# Altium schematic sheet Connectors.SchDoc: Panel
size 420 x 297 mm; Author: G.Kasprowicz; CompanyName: WUT ISE; DrawnBy: G.Kasprowicz; Organization: WUT ISE; Address1: PW ISE; Address2: Nowowiejska 15/19 00-665 Warsaw; Address3: gkasprow@gmail.com; DocumentNumber: 1; Revision: 2; SheetNumber: 1; SheetTotal: 3; ModifiedBy: -; CheckedDate: -; Title2: Connectors; DivGrp: WUT ISE; Designer: G.Kasprowicz; ModifiedDate: -; ProjectName: Sensor Box
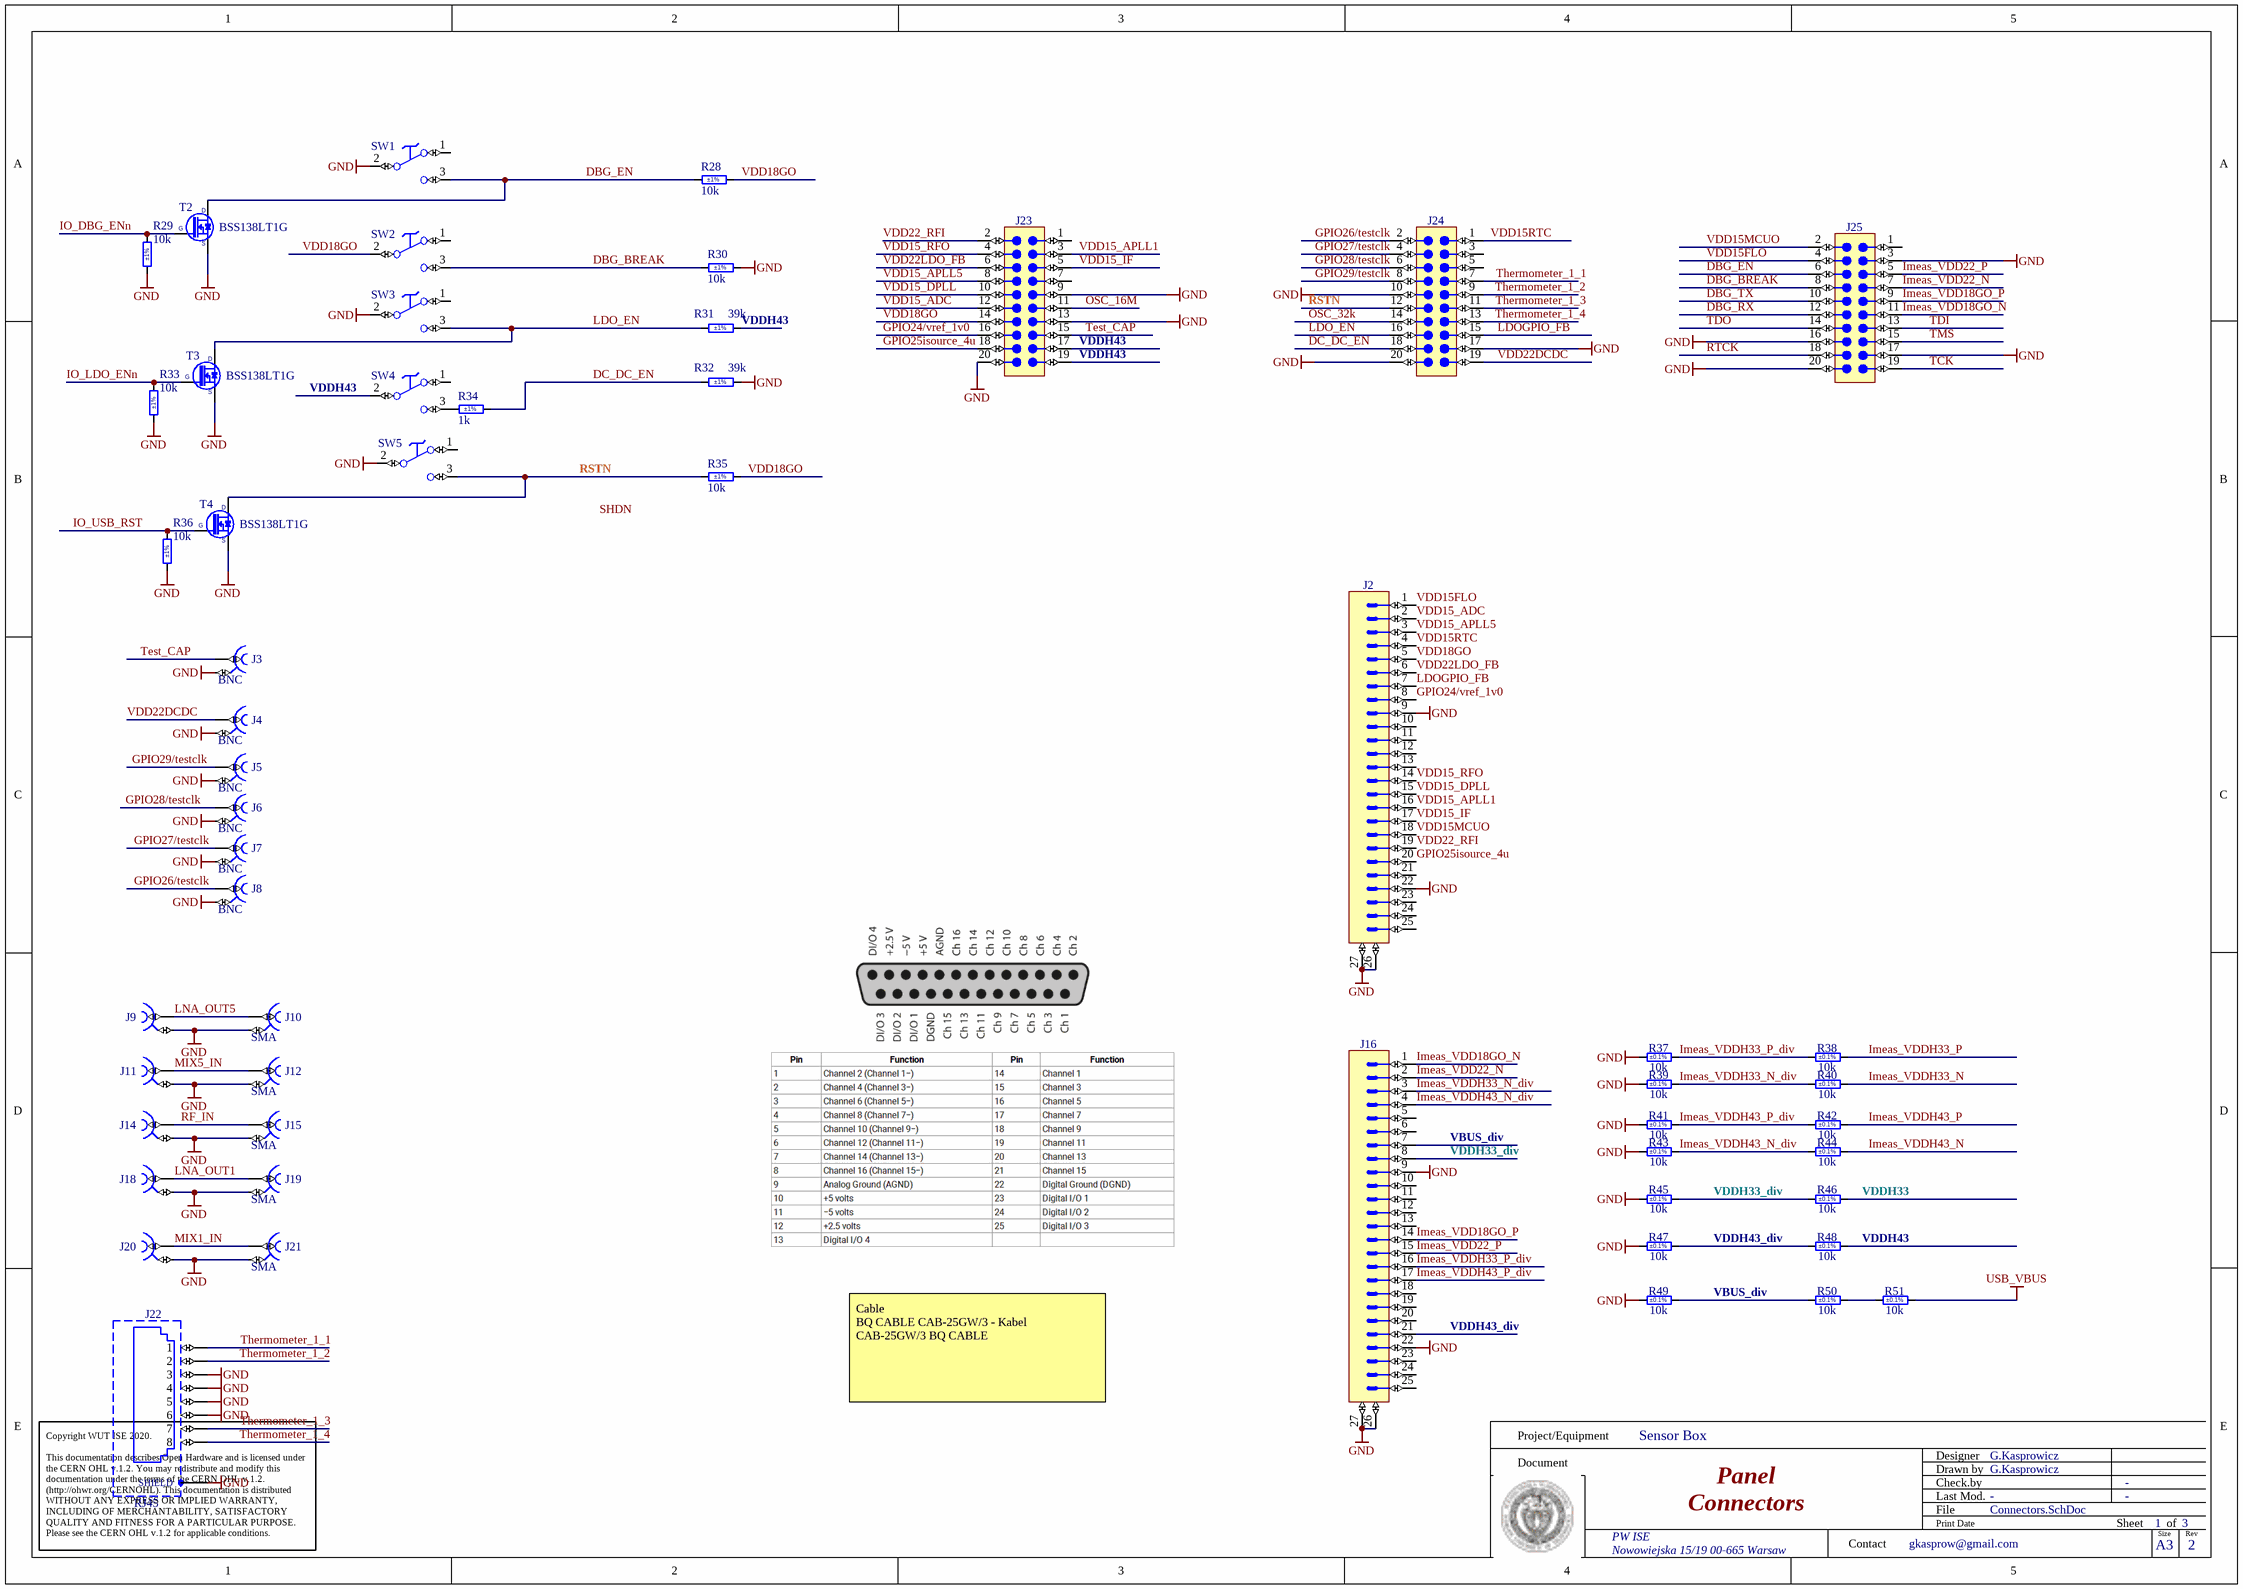
[diagram p0: Connectors.SchDoc]

## Parts
J2  D-Sub  [AMPHENOL_L717SDBH25POL2RM8C309]  (value not drawn)
J3  BNC  [TYCO_5-1634506-1]
J4  BNC  [TYCO_5-1634506-1]
J5  BNC  [TYCO_5-1634506-1]
J6  BNC  [TYCO_5-1634506-1]
J7  BNC  [TYCO_5-1634506-1]
J8  BNC  [TYCO_5-1634506-1]
J9  Coax_1Female_1Shield  [SAMTEC_MMCX-J-P-H-ST-TH1]  (value not drawn)
J10  SMA  [SAMTEC_SMA-J-P-H-ST-TH1]
J11  Coax_1Female_1Shield  [SAMTEC_MMCX-J-P-H-ST-TH1]  (value not drawn)
J12  SMA  [SAMTEC_SMA-J-P-H-ST-TH1]
J14  Coax_1Female_1Shield  [SAMTEC_MMCX-J-P-H-ST-TH1]  (value not drawn)
J15  SMA  [SAMTEC_SMA-J-P-H-ST-TH1]
J16  D-Sub  [AMPHENOL_L717SDBH25POL2RM8C309]  (value not drawn)
J18  Coax_1Female_1Shield  [SAMTEC_MMCX-J-P-H-ST-TH1]  (value not drawn)
J19  SMA  [SAMTEC_SMA-J-P-H-ST-TH1]
J20  Coax_1Female_1Shield  [SAMTEC_MMCX-J-P-H-ST-TH1]  (value not drawn)
J21  SMA  [SAMTEC_SMA-J-P-H-ST-TH1]
J22  RJ45  [TYCO_6368150-1]
J23  Header 20  [3M_45220-600230]  (value not drawn)
J24  Header 20  [3M_45220-600230]  (value not drawn)
J25  Header 20  [3M_45220-600230]  (value not drawn)
R28  10k  Tolerance: ±1%  [RESC1005X40N]
R29  10k  Tolerance: ±1%  [RESC1005X40N]
R30  10k  Tolerance: ±1%  [RESC1005X40N]
R31  39k  Tolerance: ±1%  [RESC1005X40N]
R32  39k  Tolerance: ±1%  [RESC1005X40N]
R33  10k  Tolerance: ±1%  [RESC1005X40N]
R34  1k  Tolerance: ±1%  [RESC1005X40N]
R35  10k  Tolerance: ±1%  [RESC1005X40N]
R36  10k  Tolerance: ±1%  [RESC1005X40N]
R37  10k  Tolerance: ±0.1%  [RESC1608X55N]
R38  10k  Tolerance: ±0.1%  [RESC1608X55N]
R39  10k  Tolerance: ±0.1%  [RESC1608X55N]
R40  10k  Tolerance: ±0.1%  [RESC1608X55N]
R41  10k  Tolerance: ±0.1%  [RESC1608X55N]
R42  10k  Tolerance: ±0.1%  [RESC1608X55N]
R43  10k  Tolerance: ±0.1%  [RESC1608X55N]
R44  10k  Tolerance: ±0.1%  [RESC1608X55N]
R45  10k  Tolerance: ±0.1%  [RESC1608X55N]
R46  10k  Tolerance: ±0.1%  [RESC1608X55N]
R47  10k  Tolerance: ±0.1%  [RESC1608X55N]
R48  10k  Tolerance: ±0.1%  [RESC1608X55N]
R49  10k  Tolerance: ±0.1%  [RESC1608X55N]
R50  10k  Tolerance: ±0.1%  [RESC1608X55N]
R51  10k  Tolerance: ±0.1%  [RESC1608X55N]
SW1  Switch  [SW_TYCO_1-1437575-4]  (value not drawn)
SW2  Switch  [SW_TYCO_1-1437575-4]  (value not drawn)
SW3  Switch  [SW_TYCO_1-1437575-4]  (value not drawn)
SW4  Switch  [SW_TYCO_1-1437575-4]  (value not drawn)
SW5  Switch  [SW_TYCO_1-1437575-4]  (value not drawn)
T2  BSS138LT1G  [SOT95P240X110-3N]
T3  BSS138LT1G  [SOT95P240X110-3N]
T4  BSS138LT1G  [SOT95P240X110-3N]

## Nets
GND: J2.9 J2.22 J2.26 J2.27 J3.2 J4.2 J5.2 J6.2 J7.2 J8.2 J9.2 J10.2 J11.2 J12.2 J14.2 J15.2 J16.9 J16.22 J16.26 J16.27 J18.2 J19.2 J20.2 J21.2 J22.3 J22.4 J22.5 J22.6 J22.SHIELD J23.9 J23.13 J23.20 J24.10 J24.17 J24.20 J25.3 J25.16 J25.17 J25.20 R29.2 R30.2 R32.1 R33.2 R36.2 R37.1 R39.1 R41.1 R43.1 R45.1 R47.1 R49.1 SW1.2(C) SW3.2(C) SW5.2(C) T2.2(S) T3.2(S) T4.2(S)
USB_VBUS: R51.2
DBG_BREAK: J25.8 R30.1 SW2.3(NO)
DBG_EN: J25.6 R28.1 SW1.3(NO) T2.3(D)
DBG_RX: J25.12
DBG_TX: J25.10
DC_DC_EN: J24.18 R32.2 R34.1
GPIO24/vref_1v0: J2.8 J23.16
GPIO25isource_4u: J2.20 J23.18
GPIO26/testclk: J8.1 J24.2
GPIO27/testclk: J7.1 J24.4
GPIO28/testclk: J6.1 J24.6
GPIO29/testclk: J5.1 J24.8
Imeas_VDD18GO_N: J16.1 J25.11
Imeas_VDD18GO_P: J16.14 J25.9
Imeas_VDD22_N: J16.2 J25.7
Imeas_VDD22_P: J16.15 J25.5
Imeas_VDDH33_N: R40.2
Imeas_VDDH33_N_div: J16.3 R39.2 R40.1
Imeas_VDDH33_P: R38.2
Imeas_VDDH33_P_div: J16.16 R37.2 R38.1
Imeas_VDDH43_N: R44.2
Imeas_VDDH43_N_div: J16.4 R43.2 R44.1
Imeas_VDDH43_P: R42.2
Imeas_VDDH43_P_div: J16.17 R41.2 R42.1
IO_DBG_ENn: R29.1 T2.1(G)
IO_LDO_ENn: R33.1 T3.1(G)
IO_USB_RST: R36.1 T4.1(G)
LDO_EN: J24.16 R31.2 SW3.3(NO) T3.3(D)
LDOGPIO_FB: J2.7 J24.15
LNA_OUT1: J18.1 J19.1
LNA_OUT5: J9.1 J10.1
MIX1_IN: J20.1 J21.1
MIX5_IN: J11.1 J12.1
OSC_16M: J23.11
OSC_32k: J24.14
RF_IN: J14.1 J15.1
RSTN: J24.12 R35.1 SW5.3(NO) T4.3(D)
RTCK: J25.18
TCK: J25.19
TDI: J25.13
TDO: J25.14
Test_CAP: J3.1 J23.15
Thermometer_1_1: J22.1 J24.7
Thermometer_1_2: J22.2 J24.9
Thermometer_1_3: J22.7 J24.11
Thermometer_1_4: J22.8 J24.13
TMS: J25.15
VBUS_div: J16.7 R49.2 R50.1
VDD15_ADC: J2.2 J23.12
VDD15_APLL1: J2.16 J23.3
VDD15_APLL5: J2.3 J23.8
VDD15_DPLL: J2.15 J23.10
VDD15_IF: J2.17 J23.5
VDD15_RFO: J2.14 J23.4
VDD15FLO: J2.1 J25.4
VDD15MCUO: J2.18 J25.2
VDD15RTC: J2.4 J24.1
VDD18GO: J2.5 J23.14 R28.2 R35.2 SW2.2(C)
VDD22_RFI: J2.19 J23.2
VDD22DCDC: J4.1 J24.19
VDD22LDO_FB: J2.6 J23.6
VDDH33: R46.2
VDDH33_div: J16.8 R45.2 R46.1
VDDH43: J23.17 J23.19 R31.1 R48.2 SW4.2(C)
VDDH43_div: J16.21 R47.2 R48.1
NetR34_2: R34.2 SW4.3(NO)
NetR50_2: R50.2 R51.1

Not connected (* = marked no-connect by the designer): J2 10 11 12 13 21 23 24 25; J16 5 6 10 11 12 13 18 19 20 23 24 25; J23 1 7; J24 3 5; J25 1; SW1 1(NC); SW2 1(NC); SW3 1(NC); SW4 1(NC); SW5 1(NC)

## Notes on the sheet
- Cable
  BQ CABLE CAB-25GW/3 - Kabel
  CAB-25GW/3 BQ CABLE
- Labels drawn without touching a wire or pin: SHDN
- Project/Equipment
- Document
- Designer
- Drawn by
- Check.by
- Copyright WUT ISE 2020.
  This documentation describes Open Hardware and is licensed under the CERN OHL v.1.2. You may redistribute and modify this documentation under the terms of the CERN OHL v.1.2. (http://ohwr.org/CERNOHL). This documentation is distributed WITHOUT ANY EXPRESS OR IMPLIED WARRANTY, INCLUDING OF MERCHANTABILITY, SATISFACTORY QUALITY AND FITNESS FOR A PARTICULAR PURPOSE. Please see the CERN OHL v.1.2 for applicable conditions.
- Contact
- File
- Last Mod.
- Print Date
- Sheet
- Size
- A3
- of
- Rev

## Library data of the parts
J2 J16 = AMPHENOL_L717SDBH25POL2RM8C309: Connector D-sub 25 Male; Part Description: Straight D-Sub 25 Male Contacts with Rear Insert 4-40 and Retention Clip + Front Screwlock (UNC4-40); PressFit: No; Part Number: AMPHENOL_L717SDBH25POL2RM8C309; Component Kind: Standard; Component Type: Standard; Pin Count: 27; Family: D-Sub; Mounted: Yes; Socket: No; SMD: No; Sense: No; Status: None; Manufacturer: AMPHENOL; Manufacturer Part Number: L717SDBH25POL2RM8C309; ComponentHeight: 12.9mm; HelpURL: \\cern.ch\dfs\Applications\Altium\Datasheets\AMPHENOL_L717SDBH25POL2RM8C309.pdf; Author: CERN DEM BC; CreateDate: 18.05.2021; LatestRevisionDate: 18.05.2021
J3-J8 = TYCO_5-1634506-1: Part Description: 50 Ohms BNC PCB Straight Socket; Manufacturer: TYCO ELECTRONICS; PressFit: No; Part Number: TYCO_5-1634506-1; Component Kind: Standard; Component Type: Standard; Pin Count: 2; Family: BNC; Mounted: Yes; Socket: No; SMD: No; Sense: No; Status: None; Manufacturer Part Number: 5-1634506-1; ComponentHeight: 16.7mm; HelpURL: \\cern.ch\dfs\Applications\Altium\Datasheets\TYCO_5-1634506-1.pdf; Author: CERN DEM JLC; CreateDate: 14.02.2011; LatestRevisionDate: 14.02.2011
J9 J11 J14 J18 J20 = SAMTEC_MMCX-J-P-H-ST-TH1: Part Description: Straight Through-hole 50 Ohm Micro Mini RF Jack, MMCX Series; Manufacturer: SAMTEC; PressFit: No; Part Number: SAMTEC_MMCX-J-P-H-ST-TH1; Component Kind: Standard; Component Type: Standard; Pin Count: 2; Mounted: Yes; Socket: No; SMD: No; Sense: No; Status: None; Manufacturer Part Number: MMCX-J-P-H-ST-TH1; ComponentHeight: 4.35mm; HelpURL: \\cern.ch\dfs\Applications\Altium\Datasheets\SAMTEC_MMCX-J-P-H-ST-TH1.pdf; Author: CERN DEM JLC; CreateDate: 05.12.2012; LatestRevisionDate: 05.12.2012
J10 J12 J15 J19 J21 = SAMTEC_SMA-J-P-H-ST-TH1: Part Description: 50 Ohm SMA Straight Through-hole PCB Jack; Manufacturer: SAMTEC; PressFit: No; Part Number: SAMTEC_SMA-J-P-H-ST-TH1; Component Kind: Standard; Component Type: Standard; Pin Count: 5; Family: SMA; Mounted: Yes; Socket: No; SMD: No; Sense: No; Status: None; Manufacturer Part Number: SMA-J-P-H-ST-TH1; ComponentHeight: 9.55mm; HelpURL: \\cern.ch\dfs\Applications\Altium\Datasheets\SAMTEC_SMA-J-P-H-ST-TH1.pdf; Author: CERN DEM BC; CreateDate: 11.01.2021; LatestRevisionDate: 11.01.2021
J22 = TYCO_6368150-1: Connector RJ45 + Shield; Part Description: 1 Port, RJ45 Connector,  8 Positions, Shielded, Straight, Category 5; Manufacturer: TYCO ELECTRONICS; PressFit: No; Part Number: TYCO_6368150-1; Component Kind: Standard; Component Type: Standard; Pin Count: 10; Family: RJ45; Mounted: Yes; Socket: No; SMD: No; Sense: No; Status: None; Manufacturer Part Number: 6368150-1; ComponentHeight: 17.02mm; HelpURL: \\cern.ch\dfs\Applications\Altium\Datasheets\TYCO_6368150-1.pdf; Author: CERN DEM MR; CreateDate: 18.06.2019; LatestRevisionDate: 18.06.2019
J23-J25 = 3M_45220-600230: Connector 20 Male; Part Description: 20 Contacts - 1.27mm (0.050") Pitch - Shrouded Boardmount Vertical Header Without Latch/Ejectors, 452 Series; Manufacturer: 3M; PressFit: No; Part Number: 3M_45220-600230; Component Kind: Standard; Component Type: Standard; Pin Count: 20; Family: Header 20; Mounted: Yes; Socket: No; SMD: No; Sense: No; Status: None; Manufacturer Part Number: 45220-600230; ComponentHeight: 5.64mm; HelpURL: \\cern.ch\dfs\Applications\Altium\Datasheets\3M_45220-600230.pdf; Author: CERN DEM MR; CreateDate: 15.08.2019; LatestRevisionDate: 15.08.2019
R28-R30 R33 R35 R36 = R0402_10K_1%_0.0625W_100PPM: Resistor - 1%; Part Description: General Purpose Thick Film Chip Resistor; Manufacturer: GENERIC; Manufacturer1 Part Number: 232270671003L; TC: ±100ppm/°C; PressFit: No; Value: 10k; Part Number: R0402_10K_1%_0.0625W_100PPM; Component Kind: Standard; Component Type: Standard; Pin Count: 2; Status: Not Recommended; Power: 0.0625W; Manufacturer Part Number: R0402_10K_1%_0.0625W_100PPM; Case: 0402; Mounted: Yes; Sense: No; Socket: No; SMD: Yes; Manufacturer1 Example: YAGEO PHYCOMP; Manufacturer1 ComponentHeight: 0.4mm; HelpURL: \\cern.ch\dfs\Applications\Altium\Datasheets\R0402_Phycomp_RC0402.pdf; Author: CERN DEM JLC; CreateDate: 03.12.2007; LatestRevisionDate: 17.10.2012
R31 R32 = R0402_39K_1%_0.0625W_100PPM: Resistor - 1%; Part Description: General Purpose Thick Film Chip Resistor; Manufacturer: GENERIC; Manufacturer1 Part Number: 232270673903; TC: ±100ppm/°C; PressFit: No; Value: 39k; Part Number: R0402_39K_1%_0.0625W_100PPM; Component Kind: Standard; Component Type: Standard; Pin Count: 2; Status: Not Recommended; Power: 0.0625W; Manufacturer Part Number: R0402_39K_1%_0.0625W_100PPM; Case: 0402; Mounted: Yes; Sense: No; Socket: No; SMD: Yes; Manufacturer1 Example: YAGEO PHYCOMP; Manufacturer1 ComponentHeight: 0.4mm; HelpURL: \\cern.ch\dfs\Applications\Altium\Datasheets\R0402_Phycomp_RC0402.pdf; Author: CERN DEM JLC; CreateDate: 03.12.2007; LatestRevisionDate: 17.10.2012
R34 = R0402_1K_1%_0.0625W_100PPM: Resistor - 1%; Part Description: General Purpose Thick Film Chip Resistor; Manufacturer: GENERIC; Manufacturer1 Part Number: 232270671002L; TC: ±100ppm/°C; PressFit: No; Value: 1k; Part Number: R0402_1K_1%_0.0625W_100PPM; Component Kind: Standard; Component Type: Standard; Pin Count: 2; Status: Not Recommended; Power: 0.0625W; Manufacturer Part Number: R0402_1K_1%_0.0625W_100PPM; Case: 0402; Mounted: Yes; Sense: No; Socket: No; SMD: Yes; Manufacturer1 Example: YAGEO PHYCOMP; Manufacturer1 ComponentHeight: 0.4mm; HelpURL: \\cern.ch\dfs\Applications\Altium\Datasheets\R0402_Phycomp_RC0402.pdf; Author: CERN DEM JLC; CreateDate: 03.12.2007; LatestRevisionDate: 17.10.2012
R37-R51 = R0603_10K_0.1%_0.063W_10PPM: Resistor - 0.1%; Part Description: Thin Film Chip Resistor; Manufacturer: GENERIC; Manufacturer1 Part Number: RN73C1J10KBTDF; Power: 0.063W; TC: ±10ppm; PressFit: No; Part Number: R0603_10K_0.1%_0.063W_10PPM; Component Kind: Standard; Component Type: Standard; Pin Count: 2; Value: 10k; Status: Not Recommended; Manufacturer Part Number: R0603_10K_0.1%_0.063W_10PPM; Case: 0603; Mounted: Yes; Sense: No; Socket: No; SMD: Yes; Manufacturer1 Example: TYCO HOLSWORTHY; Manufacturer1 ComponentHeight: 0.5mm; HelpURL: \\cern.ch\dfs\Applications\Altium\Datasheets\R0603_Tyco_RN73.pdf; Author: CERN DEM JLC; CreateDate: 03.12.2007; LatestRevisionDate: 13.03.2008
SW1-SW5 = SW_TYCO_1-1437575-4: SPDT Switch; Part Description: 30VDC, 100mA, Slide Low Profile SPDT Switch, SSA Series; Manufacturer: TYCO; Manufacturer Part Number: 1-1437575-4 or SSA-12; PressFit: No; Part Number: SW_TYCO_1-1437575-4; Component Kind: Standard; Component Type: Standard; Pin Count: 3; PackageDescription: Body 8.79 x 3.4mm, Slide Low Profile SPDT Switch, SSA Series; Family: Switch; Mounted: Yes; Socket: No; SMD: No; Sense: No; Status: None; ComponentHeight: 5.4mm; HelpURL: \\cern.ch\dfs\Applications\Altium\Datasheets\SW_TYCO_1-1437575-4.pdf; Author: CERN DEM JLC; CreateDate: 11.11.2013; LatestRevisionDate: 11.11.2013
T2-T4 = BSS138LT1G: N-CHANNEL MOSFET WITH DIODE; Part Description: 50V, 200mA N-Channel Enhancement Mode Field-Effect Transistor; Manufacturer: ON SEMICONDUCTOR; PressFit: No; Bonding: No; Part Number: BSS138LT1G; Component Kind: Standard; Component Type: Standard; Device: BSS138LT1G; PackageDescription: SOT23, 0.95mm Pitch; 3 Pin, 1.40mm W X 3.00mm L X 1.10mm H body, IPC Medium Density; Manufacturer Part Number: BSS138LT1G; Pin Count: 3; Case: SOT23-3; Mounted: Yes; Socket: No; SMD: Yes; Sense: No; ComponentHeight: 1.11mm; HelpURL: \\cern.ch\dfs\Applications\Altium\Datasheets\BSS138LT1G.pdf; Author: CERN DEM JLC; CreateDate: 23.03.2009; LatestRevisionDate: 23.03.2009